# EAGLE schematic buttonpad_v0.1 (EAGLE 9.6.2)
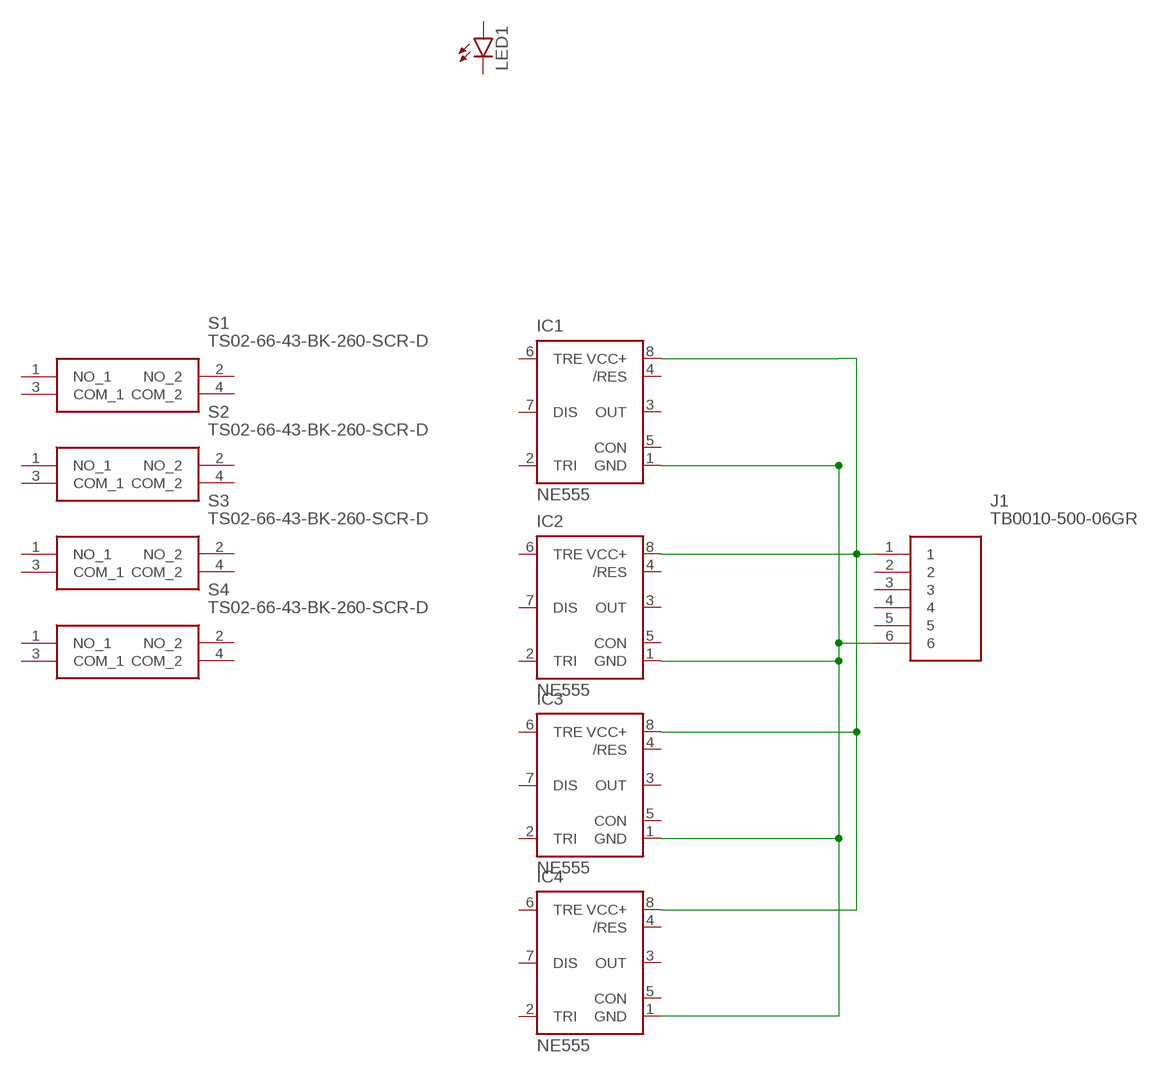
[diagram p0: schematic, sheet 1]

## Parts
IC1  NE555  [DIL-08]
IC2  NE555  [DIL-08]
IC3  NE555  [DIL-08]
IC4  NE555  [DIL-08]
J1  TB0010-500-06GR  [TB001050006GR]
LED1  LED3MM  [LED3MM]
S1  TS02-66-43-BK-260-SCR-D  [TS026643BK260SCRD]
S2  TS02-66-43-BK-260-SCR-D  [TS026643BK260SCRD]
S3  TS02-66-43-BK-260-SCR-D  [TS026643BK260SCRD]
S4  TS02-66-43-BK-260-SCR-D  [TS026643BK260SCRD]

## Nets
N$1: IC2.8(VCC+) IC3.8(VCC+) IC4.8(VCC+) J1.1
N$2: IC1.1(GND) IC2.1(GND) IC3.1(GND) IC4.1(GND) J1.6
N$3: IC1.8(VCC+)
Unconnected: IC1.2(TRI) IC1.3(OUT) IC1.4(/RES) IC1.5(CON) IC1.6(TRE) IC1.7(DIS) IC2.2(TRI) IC2.3(OUT) IC2.4(/RES) IC2.5(CON) IC2.6(TRE) IC2.7(DIS) IC3.2(TRI) IC3.3(OUT) IC3.4(/RES) IC3.5(CON) IC3.6(TRE) IC3.7(DIS) IC4.2(TRI) IC4.3(OUT) IC4.4(/RES) IC4.5(CON) IC4.6(TRE) IC4.7(DIS) J1.2 J1.3 J1.4 J1.5 LED1.A LED1.K(C) S1.1(NO_1) S1.2(NO_2) S1.3(COM_1) S1.4(COM_2) S2.1(NO_1) S2.2(NO_2) S2.3(COM_1) S2.4(COM_2) S3.1(NO_1) S3.2(NO_2) S3.3(COM_1) S3.4(COM_2) S4.1(NO_1) S4.2(NO_2) S4.3(COM_1) S4.4(COM_2)

## Library data of the parts
IC1-IC4 = st-microelectronics:NE555: General purpose bipolar Timer; MF: Arrow Electronics; MPN: NE555N; OC_FARNELL: 1467742; OC_NEWARK: 89K1486
J1 = TB0010-500-06GR:TB0010-500-06GR: 6 Position Wire to Board Terminal Block Horizontal with Board 0.197" (5.00mm) Through Hole Source: Datasheet <https://www.cuidevices.com/product/resource/tb0010-500.pdf>; DESCRIPTION: 6 Position Wire to Board Terminal Block Horizontal with Board 0.197" (5.00mm) Through Hole; HEIGHT: 13mm; MANUFACTURER_NAME: CUI Devices; MANUFACTURER_PART_NUMBER: TB0010-500-06GR; MOUSER_PART_NUMBER: 179-TB0010-500-06GR; MOUSER_PRICE-STOCK: https://www.mouser.co.uk/ProductDetail/CUI-Devices/TB0010-500-06GR?qs=HoCaDK9Nz5cKKGI8GxqoLQ%3D%3D
LED1 = led:LED: LED OSRAM: - CHIPLED LG R971, LG N971, LY N971, LG Q971, LY Q971, LO R971, LY R971 LH N974, LH R974 LS Q976, LO Q976, LY Q976 LO Q996 - Hyper CHIPLED LW Q18S LB Q993, LB Q99A, LB R99A - SideLED LS A670, LO A670, LY A670, LG A670, LP A670 LB A673, LV A673, LT A673, LW A673 LH A674 LY A675 LS A676, LA A676, LO A676, LY A676, LW A676 LS A679, LY A679, LG A679 - Hyper Micro SIDELED® LS Y876, LA Y876, LO Y876, LY Y876 LT Y87S - SmartLED LW L88C, LW L88S LB L89C, LB L89S, LG L890 LS L89K, LO L89K, LY L89K LS L896, LA L896, LO L896, LY L896 - TOPLED LS T670, LO T670, LY T670, LG T670, LP T670 LSG T670, LSP T670, LSY T670, LOP T670, LYG T670 LG T671, LOG T671, LSG T671 LB T673, LV T673, LT T673, LW T673 LH T674 LS T676, LA T676, LO T676, LY T676, LB T676, LH T676, LSB T676, LW T676 LB T67C, LV T67C, LT T67C, LS T67K, LO T67K, LY T67K, LW E67C LS E67B, LA E67B, LO E67B, LY E67B, LB E67C, LV E67C, LT E67C LW T67C LS T679, LY T679, LG T679 LS T770, LO T770, LY T770, LG T770, LP T770 LB T773, LV T773, LT T773, LW T773 LH T774 LS E675, LA E675, LY E675, LS T675 LS T776, LA T776, LO T776, LY T776, LB T776 LHGB T686 LT T68C, LB T68C - Hyper Mini TOPLED® LB M676 - Mini TOPLED Santana® LG M470 LS M47K, LO M47K, LY M47K Source: http://www.osram.convergy.de LUXEON: - LUMILED® LXK2-PW12-R00, LXK2-PW12-S00, LXK2-PW14-U00, LXK2-PW14-V00 LXK2-PM12-R00, LXK2-PM12-S00, LXK2-PM14-U00 LXK2-PE12-Q00, LXK2-PE12-R00, LXK2-PE12-S00, LXK2-PE14-T00, LXK2-PE14-U00 LXK2-PB12-K00, LXK2-PB12-L00, LXK2-PB12-M00, LXK2-PB14-N00, LXK2-PB14-P00, LXK2-PB14-Q00 LXK2-PR12-L00, LXK2-PR12-M00, LXK2-PR14-Q00, LXK2-PR14-R00 LXK2-PD12-Q00, LXK2-PD12-R00, LXK2-PD12-S00 LXK2-PH12-R00, LXK2-PH12-S00 LXK2-PL12-P00, LXK2-PL12-Q00, LXK2-PL12-R00 Source: www.luxeon.com KINGBRIGHT: KA-3528ASYC Source: www.kingbright.com
S1-S4 = TS02-66-43-BK-260-SCR-D:TS02-66-43-BK-260-SCR-D: Tactile Switches 6 x 6 mm, 4.3 mm Act Height, 260 gf, Black, Short Crimped, Through Hole, SPST, Source: Datasheet <https://www.arrow.com/en/products/ts02-66-43-bk-260-scr-d/cui-devices?region=nac>; DESCRIPTION: Tactile Switches 6 x 6 mm, 4.3 mm Act Height, 260 gf, Black, Short Crimped, Through Hole, SPST,; HEIGHT: 4.5mm; MANUFACTURER_NAME: CUI Devices; MANUFACTURER_PART_NUMBER: TS02-66-43-BK-260-SCR-D; MOUSER_PART_NUMBER: 179-TS026643BK260SCR; MOUSER_PRICE-STOCK: https://www.mouser.co.uk/ProductDetail/CUI-Devices/TS02-66-43-BK-260-SCR-D?qs=A6eO%252BMLsxmStfetPfb1PWw%3D%3D

## Net classes
0 default: width 0.635 mm
1 vcc: width 1.27 mm
2 ground: width 1.27 mm